# Altium schematic sheet ISOLATED_5V_PSU.SchDoc
size A4
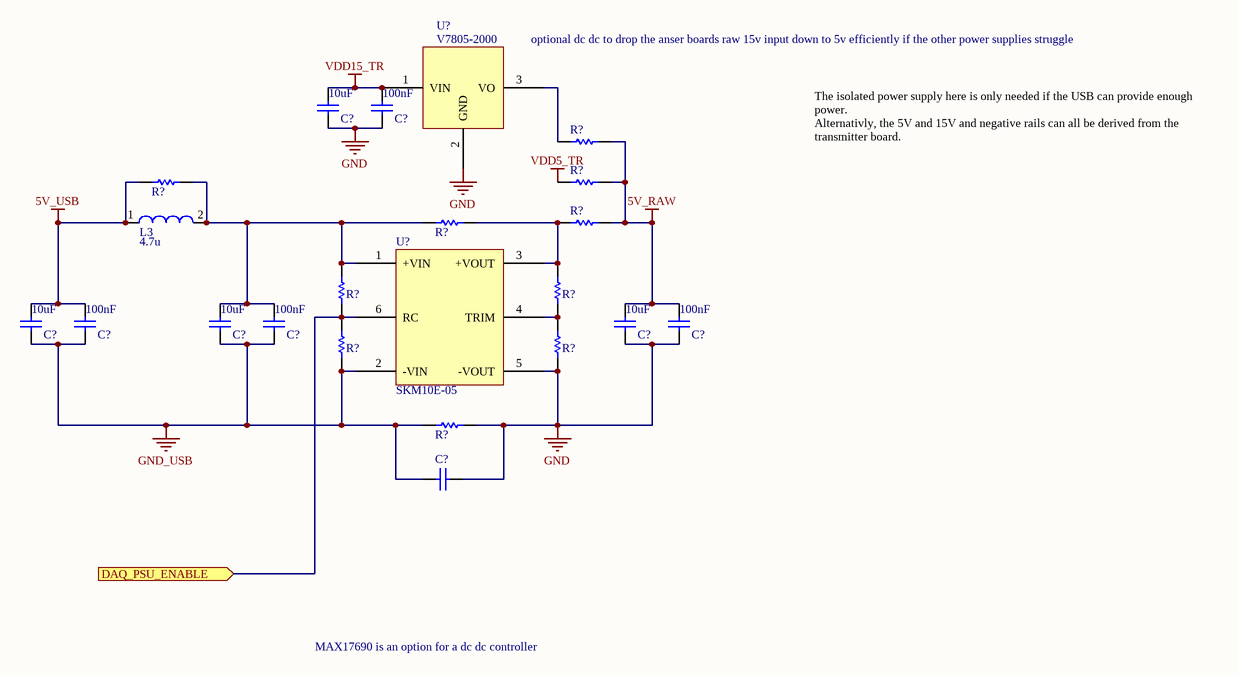
[diagram p0: ISOLATED_5V_PSU.SchDoc]

## Parts
(Parts that share a designator on the sheet are numbered #1, #2 ... from top to bottom, then left to right.)
C?#1  value 100nF  [CAPC0402(1005)60_L]  (hidden comment: CAP0402)
C?#2  value 10uF  [CAPC0805(2012)145_L]  (hidden comment: CAP0805)
C?#3  value 100nF  [CAPC0402(1005)60_L]  (hidden comment: CAP0402)
C?#4  value 100nF  [CAPC0402(1005)60_L]  (hidden comment: CAP0402)
C?#5  value 100nF  [CAPC0402(1005)60_L]  (hidden comment: CAP0402)
C?#6  value 10uF  [CAPC0805(2012)145_L]  (hidden comment: CAP0805)
C?#7  value 10uF  [CAPC0805(2012)145_L]  (hidden comment: CAP0805)
C?#8  value 10uF  [CAPC0805(2012)145_L]  (hidden comment: CAP0805)
C?#9  CAP2220  [CAPC2220(5750)230_L]  (value not drawn)
L3  L: 4.7u  [TYS5020220M-10]  (hidden comment: TYS50204R7N-10)
R?#1  RES0805  [RESC0805(2012)_L]  (value not drawn)
R?#2  RES0805  [RESC0805(2012)_L]  (value not drawn)
R?#3  RES0402  [RESC0402(1005)_L]  (value not drawn)
R?#4  Jumper 2512(6432)  [RESC2512(6432)_L]  (value not drawn)
R?#5  RES0805  [RESC0805(2012)_L]  (value not drawn)
R?#6  RES0402  [RESC0402(1005)_L]  (value not drawn)
R?#7  RES0402  [RESC0402(1005)_L]  (value not drawn)
R?#8  RES0402  [RESC0402(1005)_L]  (value not drawn)
R?#9  RES0402  [RESC0402(1005)_L]  (value not drawn)
R?#10  Jumper 2512(6432)  [RESC2512(6432)_L]  (value not drawn)
U?#1  V7805-2000  [V7805-2000]
U?#2  SKM10E-05  [SKM10E-05]

## Ports
DAQ_PSU_ENABLE (in)

## Nets
5V_RAW: C?#5.1 C?#8.2 R?#1.2 R?#2.2 R?#5.2
5V_USB: C?#3.1 C?#6.2 L3.1 R?#3.2
GND: C?#1.2 C?#2.1 C?#5.2 C?#8.1 C?#9.2 R?#9.1 R?#10.2 U?#1.2(GND) U?#2.5(-VOUT)
GND_USB: C?#3.2 C?#4.2 C?#6.1 C?#7.1 C?#9.1 R?#8.1 R?#10.1 U?#2.2(-VIN)
VDD5_TR: R?#2.1
VDD15_TR: C?#1.1 C?#2.2 U?#1.1(VIN)
DAQ_PSU_ENABLE: R?#6.1 R?#8.2 U?#2.6(RC) ; port DAQ_PSU_ENABLE
NetC?#4_1: C?#4.1 C?#7.2 L3.2 R?#3.1 R?#4.1 R?#6.2 U?#2.1(+VIN)
NetR?#1_1: R?#1.1 U?#1.3(VO)
NetR?#4_2: R?#4.2 R?#5.1 R?#7.2 U?#2.3(+VOUT)
NetR?#7_1: R?#7.1 R?#9.2 U?#2.4(TRIM)

## Notes on the sheet
- (near U?#1) optional dc dc to drop the anser boards raw 15v input down to 5v efficiently if the other power supplies struggle
- The isolated power supply here is only needed if the USB can provide enough power.
  Alternativly, the 5V and 15V and negative rails can all be derived from the transmitter board.
- MAX17690 is an option for a dc dc controller

## Library data of the parts
C?#1 C?#3-C?#5 = CMP-1590-00004-1: 0402 (1005 Metric) Chip Capacitor; Case-EIA: 0402; Case-Metric: 1005; PackageReference: CAPC0402(1005)60
C?#2 C?#6-C?#8 = CMP-1590-00003-1: 0805 (2012 Metric) Chip Capacitor; Case-EIA: 0805; Case-Metric: 2012; PackageReference: CAPC0805(2012)145
C?#9 = CMP-1590-00009-1: 2220 (5750 Metric) Chip Capacitor; Case-Metric: 5750; Case-EIA: 2220; PackageReference: CAPC2220(5750)230
L3 = TYS50204R7N-10: LAIRD TECHNOLOGIES  TYS50204R7N-10  Surface Mount Power Inductor, TYS Series, 4.7 µH, ± 30%, Shielded, 0.057 ohm, 2.2 A; Manufacturer: Wurth Elektronik; IR: 4.9 A; Isat: 5.5 A; Rdc typ.: 57 mOhm; Rdc max.: 22 mOhm; Frequence: 30 MHz; Unit Cost: .849; ComponentLink1Description: Manufacturer; ComponentLink1URL: http://ie.farnell.com/laird-technologies/tys50204r7n-10/inductor-4-7-h-smd/dp/2292526; Created by: Baojun Chen; Created Date: April 2016; ComponentLink2Description: Datasheet; ComponentLink2URL: http://katalog.we-online.com/pbs/datasheet/744066005.pdf; Maunfacturer Part Number: TYS50204R7N-10; Supplier 1: Farnell; Supplier Part Number 1: 2292526
R?#1 R?#2 R?#5 = CMP-1591-00002-1: 0805 (2012 Metric) Chip Resistor; Case-EIA: 0805; Case-Metric: 2012; PackageReference: RESC0805(2012)
R?#3 R?#6-R?#9 = CMP-1591-00004-1: 0402 (1005 Metric) Chip Resistor; Case-EIA: 0402; Case-Metric: 1005; PackageReference: RESC0402(1005)
R?#4 R?#10 = CMP-1018-00001-1: Jumper 2512 (6432 Metric); Tolerance: None; Case-EIA: 2512; Value: 0.00 Ohm; Case-Metric: 6432; Technology: SMT; Power: None
U?#1 = V7805-2000: Manufacturer: CUI Inc.; Voltage - Input (Min): 7V; Voltage - Input (Max): 18V; Voltage - Output 1: 5V; Current - Output (Max): 2A; Efficiency: 91%; Supplier 1: Digi-Key; Manufacturer Part Number: V7805-2000; RoHS: RoHS Compliant; Category: Power Supplies - Board Mount; Stock 1: 2235; Pricing 1: 1=8.21, 5=8.144, 10=8.082, 25=7.958, 50=7.7092, 100=6.9631, 250=6.83876, 500=6.71444 (EUR); Packaging: Tube; Part Status: Active; Type: Linear Regulator Replacement; Voltage - Output 2: -; Voltage - Output 3: -; Applications: ITE (Commercial); Features: OTP, SCP; Operating Temperature: -40°C ~ 85°C; Mounting Type: Through Hole; Package / Case: 3-SIP Module; Size / Dimension: 0.45" L x 0.35" W x 0.69" H (11.5mm x 9.0mm x 17.5mm); ComponentLink1URL: http://www.cui.com/product/resource/digikeypdf/v78xx-2000.pdf; ComponentLink1Description: http://www.cui.com/product/resource/digikeypdf/v78xx-2000.pdf; Supplier Part Number 1: 102-2175-ND
U?#2 = SKM10E-05: Manufacturer: Mean Well USA Inc.; Voltage - Input (Min): 4.7V; Voltage - Input (Max): 9V; Voltage - Output 1: 5V; Current - Output (Max): 2A; Efficiency: 87%; Supplier 1: Digi-Key; Manufacturer Part Number: SKM10E-05; RoHS: RoHS Compliant; Category: Power Supplies - Board Mount; Stock 1: 0; Pricing 1: 1=15.97, 10=15.723, 25=15.4772, 50=14.7404 (EUR); Packaging: -; Part Status: Active; Type: Isolated Module; Voltage - Output 2: -; Voltage - Output 3: -; Voltage - Output 4: -; Applications: ITE (Commercial); Features: Remote On/Off, OCP, OVP, UVLO; Operating Temperature: -40°C ~ 85°C (With Derating); Mounting Type: Through Hole; Package / Case: 6-DIP Module; Size / Dimension: 1.00" L x 1.00" W x 0.40" H (25.4mm x 25.4mm x 10.2mm); Supplier Device Package: -; Supplier Part Number 1: 1866-4631-ND